# Altium project sensor_V1.2.PrjPCB
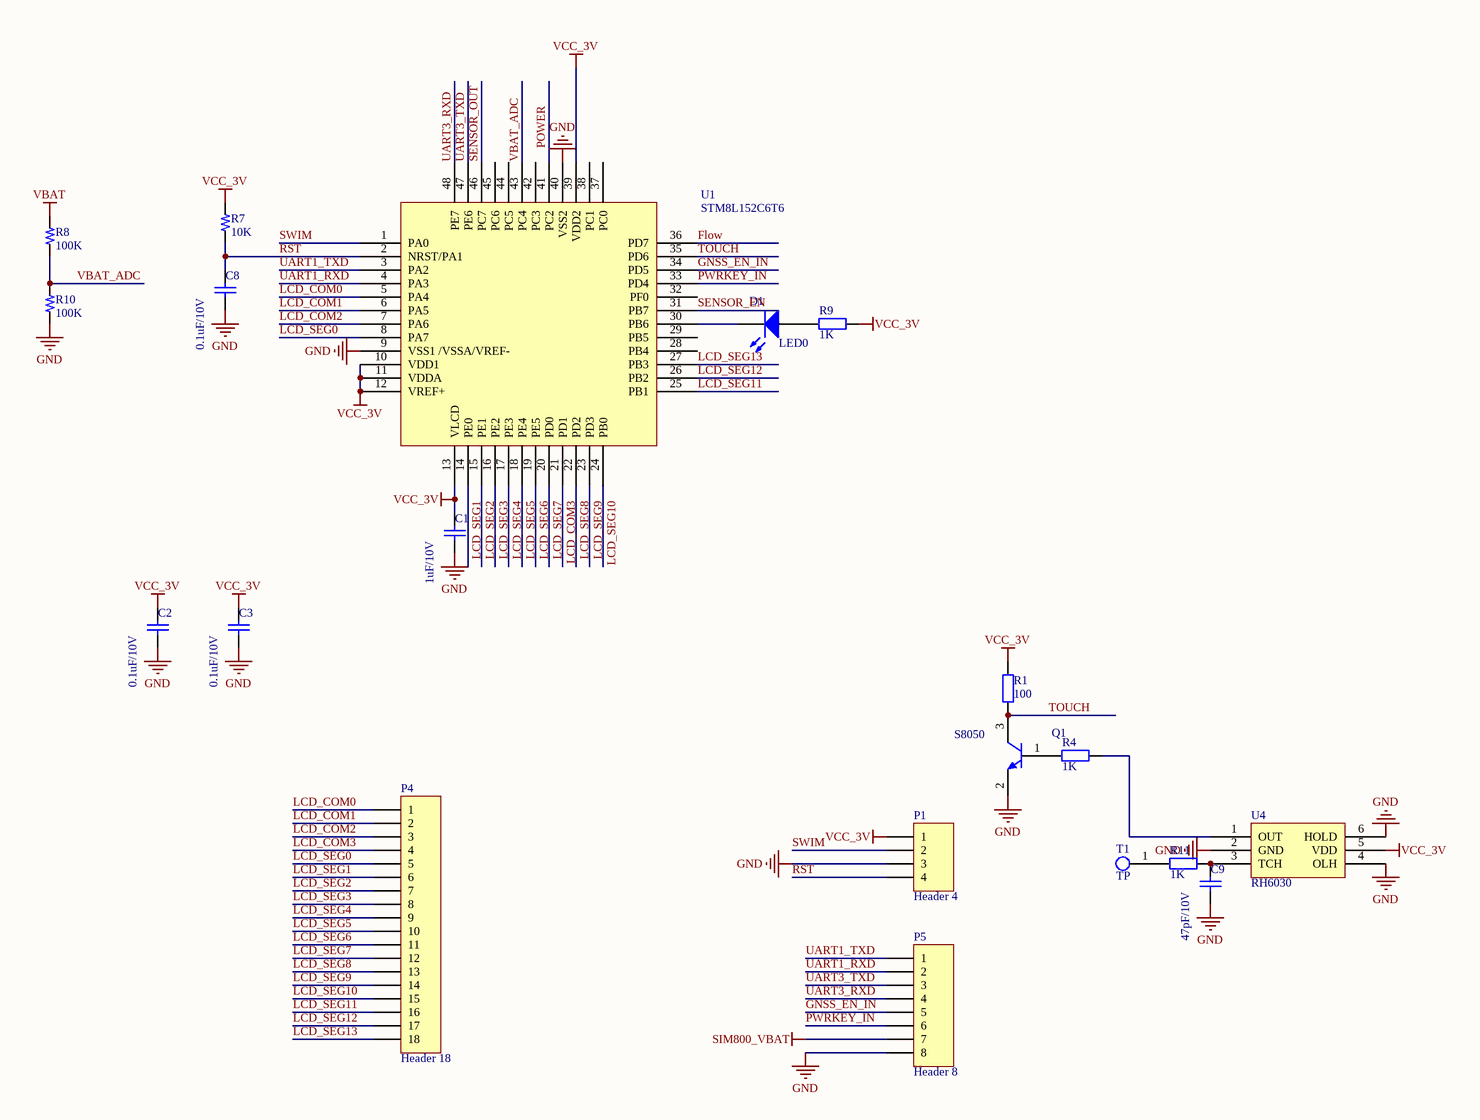
[diagram p0: MCU.SchDoc]
2 sheets, 62 parts. Net scope: global (net labels, ports and power ports of the same name join across sheets).
Board file: PCB1.PcbDoc
Sheets:
  MCU.SchDoc
  power.SchDoc

## Sheet MCU.SchDoc
size A3

### Parts
C1  1uF/10V  [0603C]
C2  0.1uF/10V  [0603C]
C3  0.1uF/10V  [0603C]
C8  0.1uF/10V  [0603C]
C9  47pF/10V  [0603C]
D1  LED0  [0603LED]
P1  Header 4  [HDR1X4]
P4  Header 18  [lcd]
P5  Header 8  [HDR1X8]
Q1  S8050  [SOT23-3]
R1  100  [0603R]
R4  1K  [0603R]
R7  10K  [0603R]
R8  100K  [0603R]
R9  1K  [0603R]
R10  100K  [0603R]
R11  1K  [0603R]
T1  TP  [TOUCH-PAD]
U1  STM8L152C6T6  [TQFP-48]
U4  RH6030  [SOT-23-6]

### Nets
GND: C1.2 C2.2 C3.2 C8.2 C9.2 P1.3 P5.8 Q1.2(E) R10.1 U1.9(VSS1_/VSSA/VREF-) U1.40(VSS2) U4.2(GND) U4.4(OLH) U4.6(HOLD)
SIM800_VBAT: P5.7 R8.2  [also labelled VBAT]
VCC_3V: C1.1 C2.1 C3.1 P1.1 R1.1 R7.2 R9.1 U1.10(VDD1) U1.11(VDDA) U1.12(VREF+) U1.13(VLCD) U1.39(VDD2) U4.5(VDD)
Flow: U1.36(PD7)
GNSS_EN_IN: P5.5 U1.34(PD5)
LCD_COM0: P4.1 U1.5(PA4)
LCD_COM1: P4.2 U1.6(PA5)
LCD_COM2: P4.3 U1.7(PA6)
LCD_COM3: P4.4 U1.21(PD1)
LCD_SEG0: P4.5 U1.8(PA7)
LCD_SEG1: P4.6 U1.14(PE0)
LCD_SEG2: P4.7 U1.15(PE1)
LCD_SEG3: P4.8 U1.16(PE2)
LCD_SEG4: P4.9 U1.17(PE3)
LCD_SEG5: P4.10 U1.18(PE4)
LCD_SEG6: P4.11 U1.19(PE5)
LCD_SEG7: P4.12 U1.20(PD0)
LCD_SEG8: P4.13 U1.22(PD2)
LCD_SEG9: P4.14 U1.23(PD3)
LCD_SEG10: P4.15 U1.24(PB0)
LCD_SEG11: P4.16 U1.25(PB1)
LCD_SEG12: P4.17 U1.26(PB2)
LCD_SEG13: P4.18 U1.27(PB3)
POWER: U1.41(PC2)
PWRKEY_IN: P5.6 U1.33(PD4)
RST: C8.1 P1.4 R7.1 U1.2(NRST/PA1)
SENSOR_EN: U1.31(PB7)
SENSOR_OUT: U1.46(PC7)
SWIM: P1.2 U1.1(PA0)
TOUCH: Q1.3(C) R1.2 U1.35(PD6)
UART1_RXD: P5.2 U1.4(PA3)
UART1_TXD: P5.1 U1.3(PA2)
UART3_RXD: P5.4 U1.48(PE7)
UART3_TXD: P5.3 U1.47(PE6)
VBAT_ADC: R8.1 R10.2 U1.43(PC4)
NetC9_1: C9.1 R11.1 U4.3(TCH)
NetD1_1: D1.1(A) R9.2
NetD1_2: D1.2(K) U1.30(PB6)
NetQ1_1: Q1.1(B) R4.2
NetR4_1: R4.1 U4.1(OUT)
NetR11_2: R11.2 T1.1

Not connected (* = marked no-connect by the designer): U1 28(PB4) 29(PB5) 32(PF0) 37(PC0) 38(PC1) 42(PC3) 44(PC5) 45(PC6)

### Library data of the parts
C1-C3 C8 C9 = Cap: Capacitor; Value: 104; Published: 8-Jun-2000; LatestRevisionDate: 17-Jul-2002; LatestRevisionNote: Re-released for DXP Platform.; PackageReference: RAD-0.3; Publisher: Altium Limited
D1 = LED0: Typical INFRARED GaAs LED; Published: 8-Jun-2000; LatestRevisionDate: 08-Jul-2005; LatestRevisionNote: Mech Layer 1 removed.; PackageReference: LED-0; Publisher: Altium Limited
P1 = Header 4: Header, 4-Pin; LatestRevisionDate: 17-Jul-2002; LatestRevisionNote: Re-released for DXP Platform.; Publisher: Altium Limited
P4 = Header 18: Header, 18-Pin; LatestRevisionDate: 17-Jul-2002; LatestRevisionNote: Re-released for DXP Platform.; Publisher: Altium Limited
P5 = Header 8: Header, 8-Pin; LatestRevisionDate: 17-Jul-2002; LatestRevisionNote: Re-released for DXP Platform.; Publisher: Altium Limited
Q1 = NPN
R1 = Res2: Resistor; Value: 1K; Published: 8-Jun-2000; LatestRevisionDate: 17-Jul-2002; LatestRevisionNote: Re-released for DXP Platform.; PackageReference: AXIAL-0.4; Publisher: Altium Limited
R4 R9 R11 = Res2: Resistor; Published: 8-Jun-2000; LatestRevisionDate: 17-Jul-2002; LatestRevisionNote: Re-released for DXP Platform.; PackageReference: AXIAL-0.4; Publisher: Altium Limited; Value: 1K
R7 R8 R10 = R

## Sheet power.SchDoc
size A3
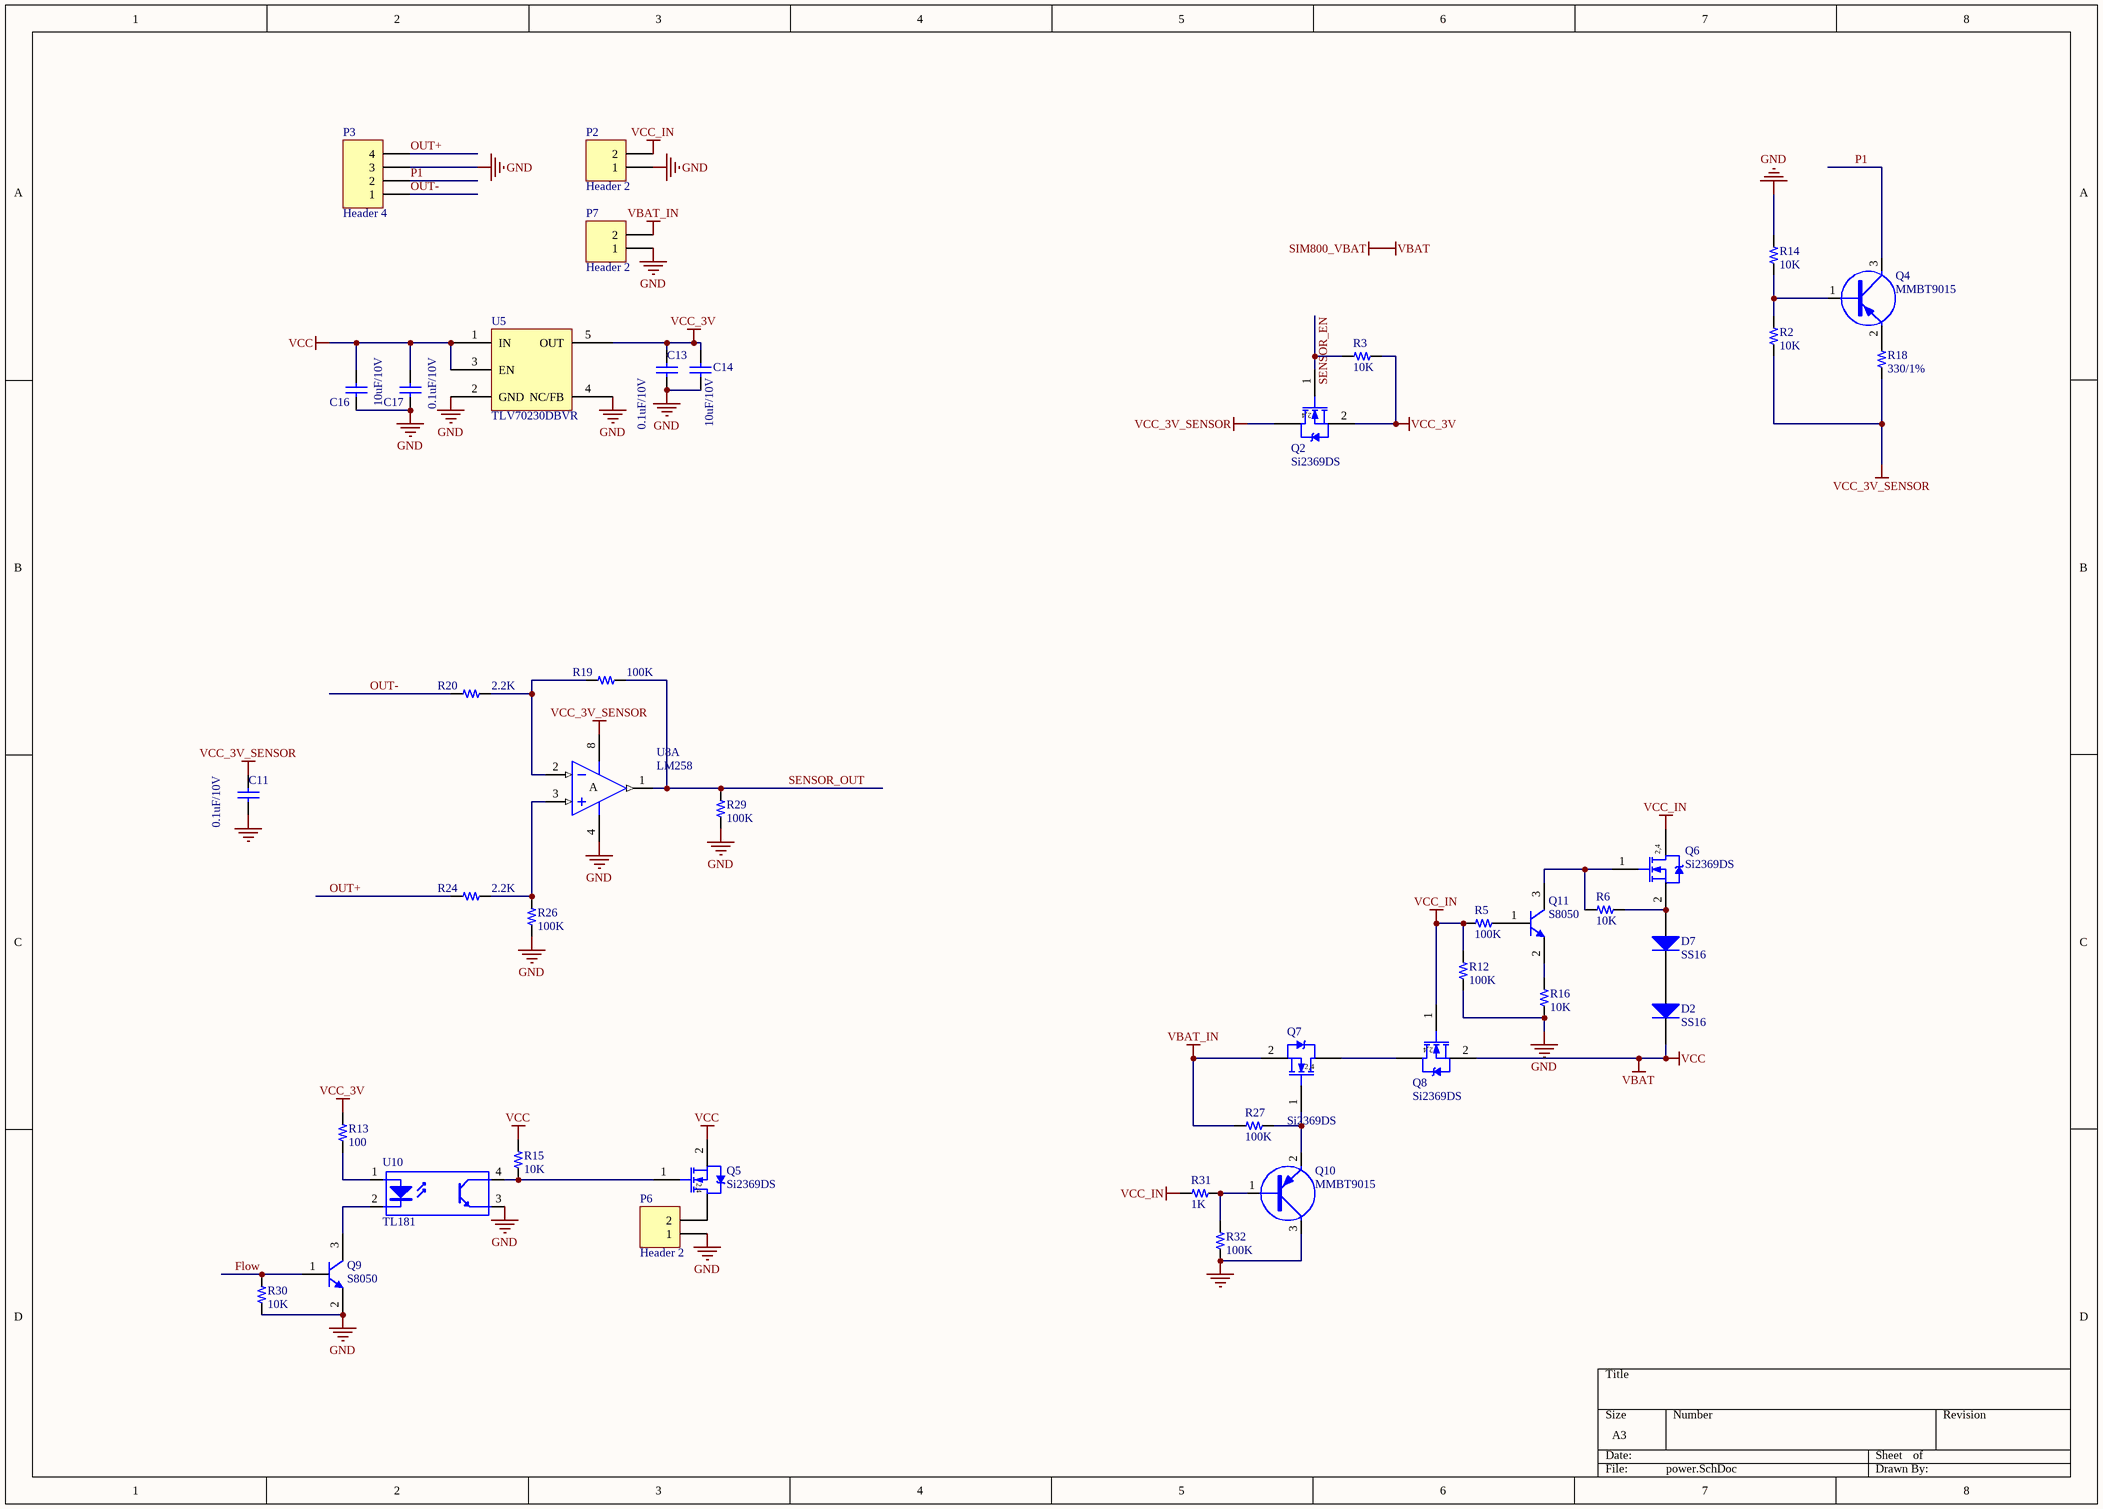
[diagram p1: power.SchDoc]

### Parts
C11  0.1uF/10V  [0603C]
C13  0.1uF/10V  [0603C]
C14  10uF/10V  [0603C]
C16  10uF/10V  [0603C]
C17  0.1uF/10V  [0603C]
D2  SS16  [SMA]
D7  SS16  [SMA]
P2  Header 2  [2X2.54MM]
P3  Header 4  [HDR1X4]
P6  Header 2  [HDR1X2]
P7  Header 2  [2X2.54MM]
Q2  Si2369DS  [SOT23-3]
Q4  MMBT9015  [SOT23-3]
Q5  Si2369DS  [SOT23-3]
Q6  Si2369DS  [SOT23-3]
Q7  Si2369DS  [SOT23-3]
Q8  Si2369DS  [SOT23-3]
Q9  S8050  [SOT23-3]
Q10  MMBT9015  [SOT23-3]
Q11  S8050  [SOT23-3]
R2  10K  [0603R]
R3  10K  [0603R]
R5  100K  [0603R]
R6  10K  [0603R]
R12  100K  [0603R]
R13  100  [0603R]
R14  10K  [0603R]
R15  10K  [0603R]
R16  10K  [0603R]
R18  330/1%  [0603R]
R19  100K  [0603R]
R20  2.2K  [0603R]
R24  2.2K  [0603R]
R26  100K  [0603R]
R27  100K  [0603R]
R29  100K  [0603R]
R30  10K  [0603R]
R31  1K  [0603R]
R32  100K  [0603R]
U5  TLV70230DBVR  [SOT23-5(DBV)]
U8  LM258  [so-8]  (part A of 2)
U10  TL181  [DIP-4]

### Nets
GND: C11.2 C13.2 C14.1 C16.1 C17.2 P2.1 P3.3 P6.1 P7.1 Q9.2(E) Q10.3(C) R12.2 R14.2 R16.1 R26.1 R29.1 R30.1 R32.1 U5.2(GND) U5.4(NC/FB) U8.4(V-) U10.3(E)
SIM800_VBAT: C16.2 C17.1 D2.2(K) Q5.2(S) Q8.2(S) R15.2 U5.1(IN) U5.3(EN)  [also labelled VBAT, VCC]
VBAT_IN: P7.2 Q7.2(S) R27.1
VCC_3V: C13.1 C14.2 Q2.2(S) R3.1 R13.2 U5.5(OUT)
VCC_3V_SENSOR: C11.1 Q2.3(D) R2.1 R18.1 U8.8(V+)
VCC_IN: P2.2 Q6.3(D) Q8.1(G) R5.1 R12.1 R31.1
Flow: Q9.1(B) R30.2
OUT+: P3.4 R24.1
OUT-: P3.1 R20.1
P1: P3.2 Q4.3(C)
SENSOR_EN: Q2.1(G) R3.2
SENSOR_OUT: R19.2 R29.2 U8.1(OUT)
NetD2_1: D2.1(A) D7.2(K)
NetD7_1: D7.1(A) Q6.2(S) R6.1
NetP6_2: P6.2 Q5.3(D)
NetQ4_1: Q4.1(B) R2.2 R14.1
NetQ4_2: Q4.2(E) R18.2
NetQ5_1: Q5.1(G) R15.1 U10.4(C)
NetQ6_1: Q6.1(G) Q11.3(C) R6.2
NetQ7_1: Q7.1(G) Q10.2(E) R27.2
NetQ7_3: Q7.3(D) Q8.3(D)
NetQ9_3: Q9.3(C) U10.2(K)
NetQ10_1: Q10.1(B) R31.2 R32.2
NetQ11_1: Q11.1(B) R5.2
NetQ11_2: Q11.2(E) R16.2
NetR13_1: R13.1 U10.1(A)
NetR19_1: R19.1 R20.2 U8.2(IN-)
NetR24_2: R24.2 R26.2 U8.3(IN+)

### Notes on the sheet
- (in symbol BUK92150-55A) 2,4
- (in symbol LM258, part A) A
- (in symbol LM258, part B) A

### Library data of the parts
C11 C13 C17 = Cap: Capacitor; Value: 104; Published: 8-Jun-2000; LatestRevisionDate: 17-Jul-2002; LatestRevisionNote: Re-released for DXP Platform.; PackageReference: RAD-0.3; Publisher: Altium Limited
C14 = Cap: Capacitor; Published: 8-Jun-2000; LatestRevisionDate: 17-Jul-2002; LatestRevisionNote: Re-released for DXP Platform.; PackageReference: RAD-0.3; Publisher: Altium Limited; Value: 10uF/10V
C16 = Cap: Capacitor; Value: 106/50V; Published: 8-Jun-2000; LatestRevisionDate: 17-Jul-2002; LatestRevisionNote: Re-released for DXP Platform.; PackageReference: RAD-0.3; Publisher: Altium Limited
D2 D7 = Diode 1N4148: High Conductance Fast Diode; Published: 8-Jun-2000; LatestRevisionDate: 17-Jul-2002; LatestRevisionNote: Re-released for DXP Platform.; DatasheetVersion: 1997; PackageReference: DO-35; Publisher: Altium Limited; Code_JEDEC: DO-204-AH; ComponentLink1Description: Manufacturer Link; ComponentLink1URL: http://www.fairchildsemi.com/; ComponentLink2Description: Datasheet; ComponentLink2URL: http://www.fairchildsemi.com/ds/1N%2F1N4148.pdf
P2 P6 P7 = Header 2: Header, 2-Pin; LatestRevisionDate: 17-Jul-2002; LatestRevisionNote: Re-released for DXP Platform.; Publisher: Altium Limited
P3 = Header 4: Header, 4-Pin; LatestRevisionDate: 17-Jul-2002; LatestRevisionNote: Re-released for DXP Platform.; Publisher: Altium Limited
Q2 Q5-Q8 = BUK92150-55A: Published: 8-Jun-2000; LatestRevisionDate: 17-Jul-2002; LatestRevisionNote: Re-released for DXP Platform.; DatasheetVersion: 6-Oct-1997; PackageVersion: Aug-1998; PackageReference: TSOP-6; Publisher: Altium Limited; PackageDescription: SOT-457/SC-74; 6 Leads; Body 3.1 x 3 mm, inc. leads (LxW max); ComponentLink1Description: Manufacturer Link; ComponentLink1URL: http://www.vishay.com/; ComponentLink2Description: Datasheet; ComponentLink2URL: http://www.vishay.com/docs/70192/70192.pdf
Q4 Q10 = PNP
Q9 Q11 = NPN
R2 R3 R5 R6 R12-R16 R18-R20 R24 R26 R27 R29-R32 = R
U10 = Optoisolator1: 4-Pin Phototransistor Optocoupler; Published: 24-Mar-1999; LatestRevisionDate: 04-Mar-2005; LatestRevisionNote: Sch pins 3 & 4 Swapped.; DatasheetVersion: Nov-2003; PackageReference: DIP-4; Publisher: Altium Limited

## Nets that join several sheets
GND: MCU (14 pins), power (22 pins)
SIM800_VBAT: MCU (P5.7 R8.2), power (8 pins)
VCC_3V: MCU (13 pins), power (6 pins)
Flow: MCU (U1.36), power (Q9.1 R30.2)
SENSOR_EN: MCU (U1.31), power (Q2.1 R3.2)
SENSOR_OUT: MCU (U1.46), power (R19.2 R29.2 U8.1)